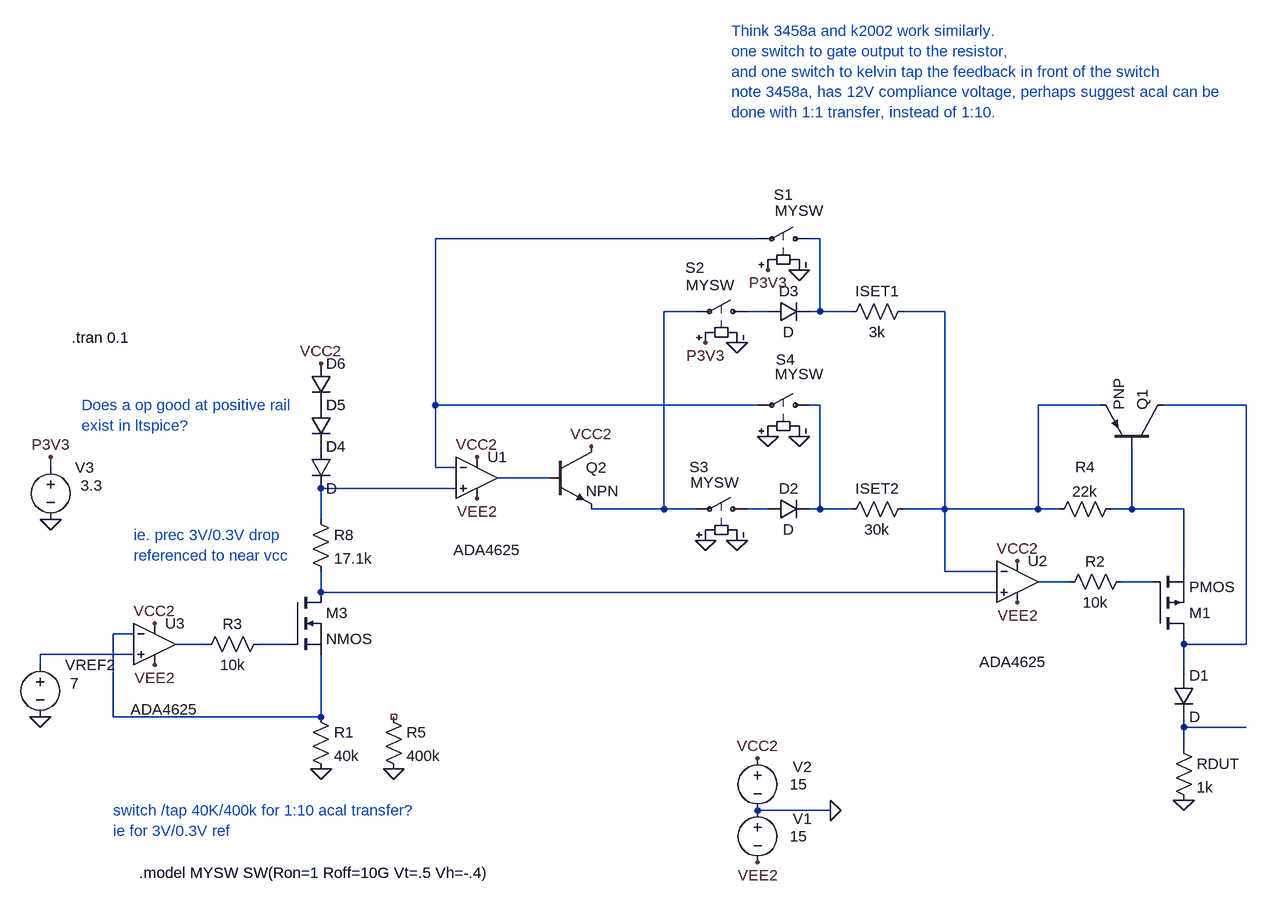
[diagram p0: schematic Draft20.asc]
Draft20.asc, the LTspice schematic file:
Version 4
SHEET 1 1768 872
WIRE 16 -400 -480 -400
WIRE 112 -400 96 -400
WIRE -80 -288 -128 -288
WIRE 32 -288 0 -288
WIRE 112 -288 112 -400
WIRE 112 -288 96 -288
WIRE 160 -288 112 -288
WIRE 304 -288 240 -288
WIRE -480 -144 -480 -400
WIRE 16 -144 -480 -144
WIRE 112 -144 96 -144
WIRE 544 -144 448 -144
WIRE 768 -144 640 -144
WIRE -1072 -48 -1072 -64
WIRE -480 -48 -480 -144
WIRE -448 -48 -480 -48
WIRE -304 -32 -384 -32
WIRE -448 -16 -656 -16
WIRE -128 16 -128 -288
WIRE -128 16 -240 16
WIRE -80 16 -128 16
WIRE 32 16 0 16
WIRE 112 16 112 -144
WIRE 112 16 96 16
WIRE 160 16 112 16
WIRE 304 16 304 -288
WIRE 304 16 240 16
WIRE 448 16 448 -144
WIRE 448 16 304 16
WIRE 480 16 448 16
WIRE 592 16 592 -80
WIRE 592 16 560 16
WIRE 672 16 592 16
WIRE -656 32 -656 -16
WIRE 304 112 304 16
WIRE 384 112 304 112
WIRE 672 112 672 16
WIRE 496 128 448 128
WIRE 624 128 576 128
WIRE -656 144 -656 112
WIRE 384 144 -656 144
WIRE -656 160 -656 144
WIRE -944 208 -976 208
WIRE -832 224 -880 224
WIRE -704 224 -752 224
WIRE 672 224 672 208
WIRE 768 224 768 -144
WIRE 768 224 672 224
WIRE -944 240 -1088 240
WIRE -1088 256 -1088 240
WIRE 672 272 672 224
WIRE -976 336 -976 208
WIRE -656 336 -656 240
WIRE -656 336 -976 336
WIRE 672 352 672 336
WIRE 768 352 672 352
WIRE 672 384 672 352
WIRE 128 480 16 480
FLAG 128 480 0
FLAG 16 560 VEE2
FLAG 16 400 VCC2
FLAG 416 160 VEE2
FLAG 416 96 VCC2
FLAG -416 0 VEE2
FLAG -416 -64 VCC2
FLAG 672 464 0
FLAG -16 64 0
FLAG -16 -240 0
FLAG 80 -352 0
FLAG 80 -96 0
FLAG -240 -80 VCC2
FLAG -912 256 VEE2
FLAG -912 192 VCC2
FLAG -1088 336 0
FLAG -656 416 0
FLAG -656 -208 VCC2
FLAG 32 -96 0
FLAG -64 64 0
FLAG -1072 32 0
FLAG -1072 -64 P3V3
FLAG -64 -240 P3V3
FLAG 32 -352 P3V3
FLAG -544 416 0
SYMBOL voltage 16 464 R0
WINDOW 0 54 29 Left 2
WINDOW 3 50 56 Left 2
WINDOW 123 0 0 Left 0
WINDOW 39 0 0 Left 0
SYMATTR InstName V1
SYMATTR Value 15
SYMBOL res 656 368 R0
SYMATTR InstName RDUT
SYMATTR Value 1k
SYMBOL res 256 0 R90
WINDOW 0 0 56 VBottom 2
WINDOW 3 32 56 VTop 2
SYMATTR InstName ISET2
SYMATTR Value 30k
SYMBOL pmos 624 208 M180
SYMATTR InstName M1
SYMBOL voltage 16 384 R0
WINDOW 0 54 29 Left 2
WINDOW 3 50 56 Left 2
WINDOW 123 0 0 Left 0
WINDOW 39 0 0 Left 0
SYMATTR InstName V2
SYMATTR Value 15
SYMBOL res 592 112 R90
WINDOW 0 0 56 VBottom 2
WINDOW 3 32 56 VTop 2
SYMATTR InstName R2
SYMATTR Value 10k
SYMBOL res 576 0 R90
WINDOW 0 -33 56 VBottom 2
WINDOW 3 -27 56 VTop 2
SYMATTR InstName R4
SYMATTR Value 22k
SYMBOL pnp 640 -80 M270
SYMATTR InstName Q1
SYMBOL OpAmps\\ADA4625 416 64 R0
WINDOW 3 -59 187 Left 2
SYMATTR InstName U2
SYMBOL diode 656 272 R0
SYMATTR InstName D1
SYMBOL OpAmps\\ADA4625 -416 -96 R0
WINDOW 3 -36 175 Left 2
SYMATTR InstName U1
SYMBOL diode 32 32 R270
WINDOW 0 32 32 VTop 2
WINDOW 3 0 32 VBottom 2
SYMATTR InstName D2
SYMBOL res 256 -304 R90
WINDOW 0 0 56 VBottom 2
WINDOW 3 32 56 VTop 2
SYMATTR InstName ISET1
SYMATTR Value 3k
SYMBOL diode 32 -272 R270
WINDOW 0 32 32 VTop 2
WINDOW 3 0 32 VBottom 2
SYMATTR InstName D3
SYMBOL sw 112 -400 M270
WINDOW 0 68 71 VLeft 2
WINDOW 3 43 69 VLeft 2
SYMATTR InstName S1
SYMATTR Value MYSW
SYMBOL sw 16 -288 M270
WINDOW 0 68 111 VLeft 2
WINDOW 3 41 110 VLeft 2
SYMATTR InstName S2
SYMATTR Value MYSW
SYMBOL sw 16 16 M270
WINDOW 0 65 105 VLeft 2
WINDOW 3 41 103 VLeft 2
SYMATTR InstName S3
SYMATTR Value MYSW
SYMBOL sw 112 -144 M270
WINDOW 0 70 68 VLeft 2
WINDOW 3 48 69 VLeft 2
SYMATTR InstName S4
SYMATTR Value MYSW
SYMBOL npn -304 -80 R0
SYMATTR InstName Q2
SYMBOL res -672 320 R0
SYMATTR InstName R1
SYMATTR Value 40k
SYMBOL res -736 208 R90
WINDOW 0 0 56 VBottom 2
WINDOW 3 32 56 VTop 2
SYMATTR InstName R3
SYMATTR Value 10k
SYMBOL OpAmps\\ADA4625 -912 160 R0
WINDOW 3 -37 164 Left 2
SYMATTR InstName U3
SYMBOL voltage -1088 240 R0
WINDOW 123 0 0 Left 0
WINDOW 39 0 0 Left 0
WINDOW 3 46 44 Left 2
WINDOW 0 38 16 Left 2
SYMATTR Value 7
SYMATTR InstName VREF2
SYMBOL res -672 16 R0
SYMATTR InstName R8
SYMATTR Value 17.1k
SYMBOL nmos -704 144 R0
SYMATTR InstName M3
SYMBOL diode -672 -80 R0
SYMATTR InstName D4
SYMBOL diode -672 -144 R0
SYMATTR InstName D5
SYMBOL voltage -1072 -64 R0
WINDOW 123 0 0 Left 0
WINDOW 39 0 0 Left 0
WINDOW 3 46 44 Left 2
WINDOW 0 38 16 Left 2
SYMATTR Value 3.3
SYMATTR InstName V3
SYMBOL res -560 320 R0
SYMATTR InstName R5
SYMATTR Value 400k
SYMBOL diode -672 -208 R0
SYMATTR InstName D6
TEXT -1040 -248 Left 2 !.tran 0.1
TEXT -24 -720 Left 2 ;Think 3458a and k2002 work similarly. \none switch to gate output to the resistor,\nand one switch to kelvin tap the feedback in front of the switch\nnote 3458a, has 12V compliance voltage, perhaps suggest acal can be\ndone with 1:1 transfer, instead of 1:10.
TEXT -976 480 Left 2 ;switch /tap 40K/400k for 1:10 acal transfer?\nie for 3V/0.3V ref
TEXT -944 56 Left 2 ;ie. prec 3V/0.3V drop\nreferenced to near vcc
TEXT -936 576 Left 2 !.model MYSW SW(Ron=1 Roff=10G Vt=.5 Vh=-.4)
TEXT -1024 -144 Left 2 ;Does a op good at positive rail \nexist in ltspice?

The netlist it stands for:
* Draft20.asc
V1 0 VEE2 15
RDUT N019 0 1k
R§ISET2 N005 N006 30k
M1 N007 N013 N011 N011 PMOS
V2 VCC2 0 15
R2 N013 N012 10k
R4 N011 N005 22k
Q1 N007 N011 N005 0 PNP
XU2 N014 N005 VCC2 VEE2 N012 ADA4625  ; pins In+ In- V+ V- OUT
D1 N007 N019 D
XU1 N009 N001 VCC2 VEE2 N008 ADA4625  ; pins In+ In- V+ V- OUT
D2 N010 N006 D
R§ISET1 N005 N002 3k
D3 N004 N002 D
S1 N002 N001 P3V3 0 MYSW
S2 N004 N003 P3V3 0 MYSW
S3 N010 N003 0 0 MYSW
S4 N006 N001 0 0 MYSW
Q2 VCC2 N008 N003 0 NPN
R1 N015 0 40k
R3 N017 N016 10k
XU3 N018 N015 VCC2 VEE2 N016 ADA4625  ; pins In+ In- V+ V- OUT
VREF2 N018 0 7
R8 N009 N014 17.1k
M3 N014 N017 N015 N015 NMOS
D4 P001 N009 D
D5 P002 P001 D
V3 P3V3 0 3.3
R5 NC_01 0 400k
D6 VCC2 P002 D
.model D D
.lib standard.dio
.model NPN NPN
.model PNP PNP
.lib standard.bjt
.model NMOS NMOS
.model PMOS PMOS
.lib standard.mos
.tran 0.1
* Think 3458a and k2002 work similarly.
* one switch to gate output to the resistor,
* and one switch to kelvin tap the feedback in front of the switch
* note 3458a, has 12V compliance voltage, perhaps suggest acal can be
* done with 1:1 transfer, instead of 1:10.
* switch /tap 40K/400k for 1:10 acal transfer?
* ie for 3V/0.3V ref
* ie. prec 3V/0.3V drop
* referenced to near vcc
.model MYSW SW(Ron=1 Roff=10G Vt=.5 Vh=-.4)
* Does a op good at positive rail
* exist in ltspice?
.backanno
.end